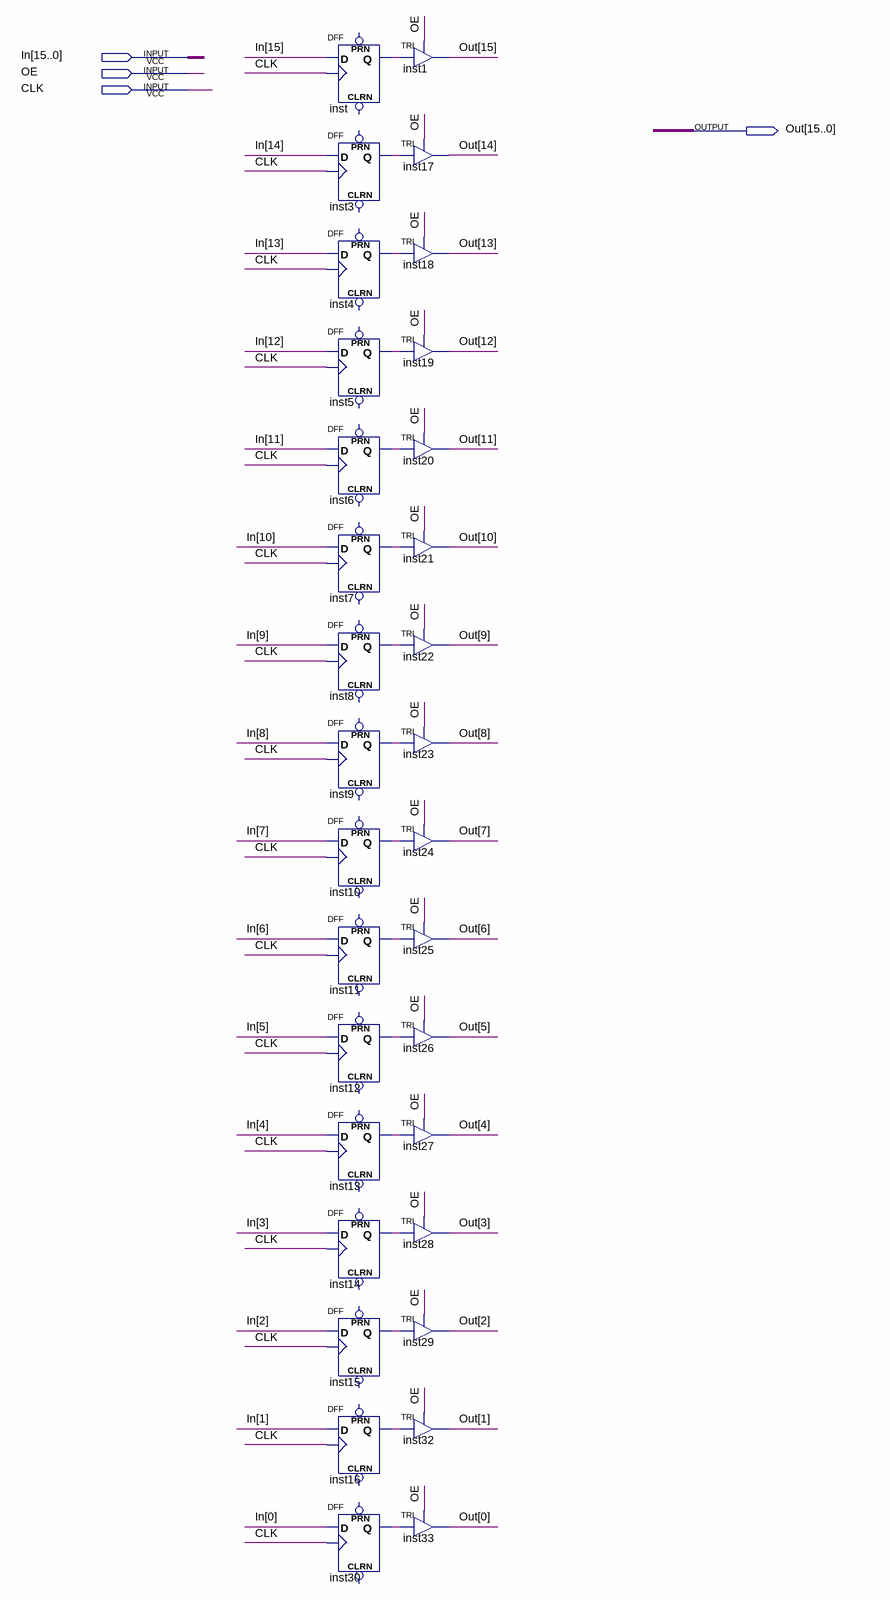
[diagram p0: schematic sheet]
// Quartus schematic Register_16bit_for_Stable_Output.bdf as structural Verilog: 32 symbols, 4 pins
module Register_16bit_for_Stable_Output (
  input  [15:0] In,
  input  OE,
  input  CLK,
  output [15:0] Out
);

  wire inst3_q, inst4_q, inst5_q, inst6_q, inst7_q, inst8_q, inst9_q, inst10_q, inst11_q, inst12_q, inst13_q,
       inst14_q, inst15_q, inst16_q, inst30_q, inst_q;

  DFF inst (.CLK(CLK), .D(In[15]), .Q(inst_q));  // open: CLRN, PRN
  DFF inst3 (.CLK(CLK), .D(In[14]), .Q(inst3_q));  // open: CLRN, PRN
  DFF inst4 (.CLK(CLK), .D(In[13]), .Q(inst4_q));  // open: CLRN, PRN
  DFF inst5 (.CLK(CLK), .D(In[12]), .Q(inst5_q));  // open: CLRN, PRN
  DFF inst6 (.CLK(CLK), .D(In[11]), .Q(inst6_q));  // open: CLRN, PRN
  DFF inst7 (.CLK(CLK), .D(In[10]), .Q(inst7_q));  // open: CLRN, PRN
  DFF inst8 (.CLK(CLK), .D(In[9]), .Q(inst8_q));  // open: CLRN, PRN
  DFF inst9 (.CLK(CLK), .D(In[8]), .Q(inst9_q));  // open: CLRN, PRN
  DFF inst10 (.CLK(CLK), .D(In[7]), .Q(inst10_q));  // open: CLRN, PRN
  DFF inst11 (.CLK(CLK), .D(In[6]), .Q(inst11_q));  // open: CLRN, PRN
  DFF inst12 (.CLK(CLK), .D(In[5]), .Q(inst12_q));  // open: CLRN, PRN
  DFF inst13 (.CLK(CLK), .D(In[4]), .Q(inst13_q));  // open: CLRN, PRN
  DFF inst14 (.CLK(CLK), .D(In[3]), .Q(inst14_q));  // open: CLRN, PRN
  DFF inst15 (.CLK(CLK), .D(In[2]), .Q(inst15_q));  // open: CLRN, PRN
  DFF inst16 (.CLK(CLK), .D(In[1]), .Q(inst16_q));  // open: CLRN, PRN
  DFF inst30 (.CLK(CLK), .D(In[0]), .Q(inst30_q));  // open: CLRN, PRN
  TRI inst1 (.IN(inst_q), .OE(OE), .OUT(Out[15]));
  TRI inst17 (.IN(inst3_q), .OE(OE), .OUT(Out[14]));
  TRI inst18 (.IN(inst4_q), .OE(OE), .OUT(Out[13]));
  TRI inst19 (.IN(inst5_q), .OE(OE), .OUT(Out[12]));
  TRI inst20 (.IN(inst6_q), .OE(OE), .OUT(Out[11]));
  TRI inst21 (.IN(inst7_q), .OE(OE), .OUT(Out[10]));
  TRI inst22 (.IN(inst8_q), .OE(OE), .OUT(Out[9]));
  TRI inst23 (.IN(inst9_q), .OE(OE), .OUT(Out[8]));
  TRI inst24 (.IN(inst10_q), .OE(OE), .OUT(Out[7]));
  TRI inst25 (.IN(inst11_q), .OE(OE), .OUT(Out[6]));
  TRI inst26 (.IN(inst12_q), .OE(OE), .OUT(Out[5]));
  TRI inst27 (.IN(inst13_q), .OE(OE), .OUT(Out[4]));
  TRI inst28 (.IN(inst14_q), .OE(OE), .OUT(Out[3]));
  TRI inst29 (.IN(inst15_q), .OE(OE), .OUT(Out[2]));
  TRI inst32 (.IN(inst16_q), .OE(OE), .OUT(Out[1]));
  TRI inst33 (.IN(inst30_q), .OE(OE), .OUT(Out[0]));
endmodule
